# Altium schematic sheet STM32_microcontroller_IOs.SchDoc: STM32 microcontroller IOs
size 420 x 297 mm; CompanyName: STMicroelectronics; Organization: Microcontrollers Division; DocumentNumber: 4; SheetNumber: 3; SheetTotal: 19
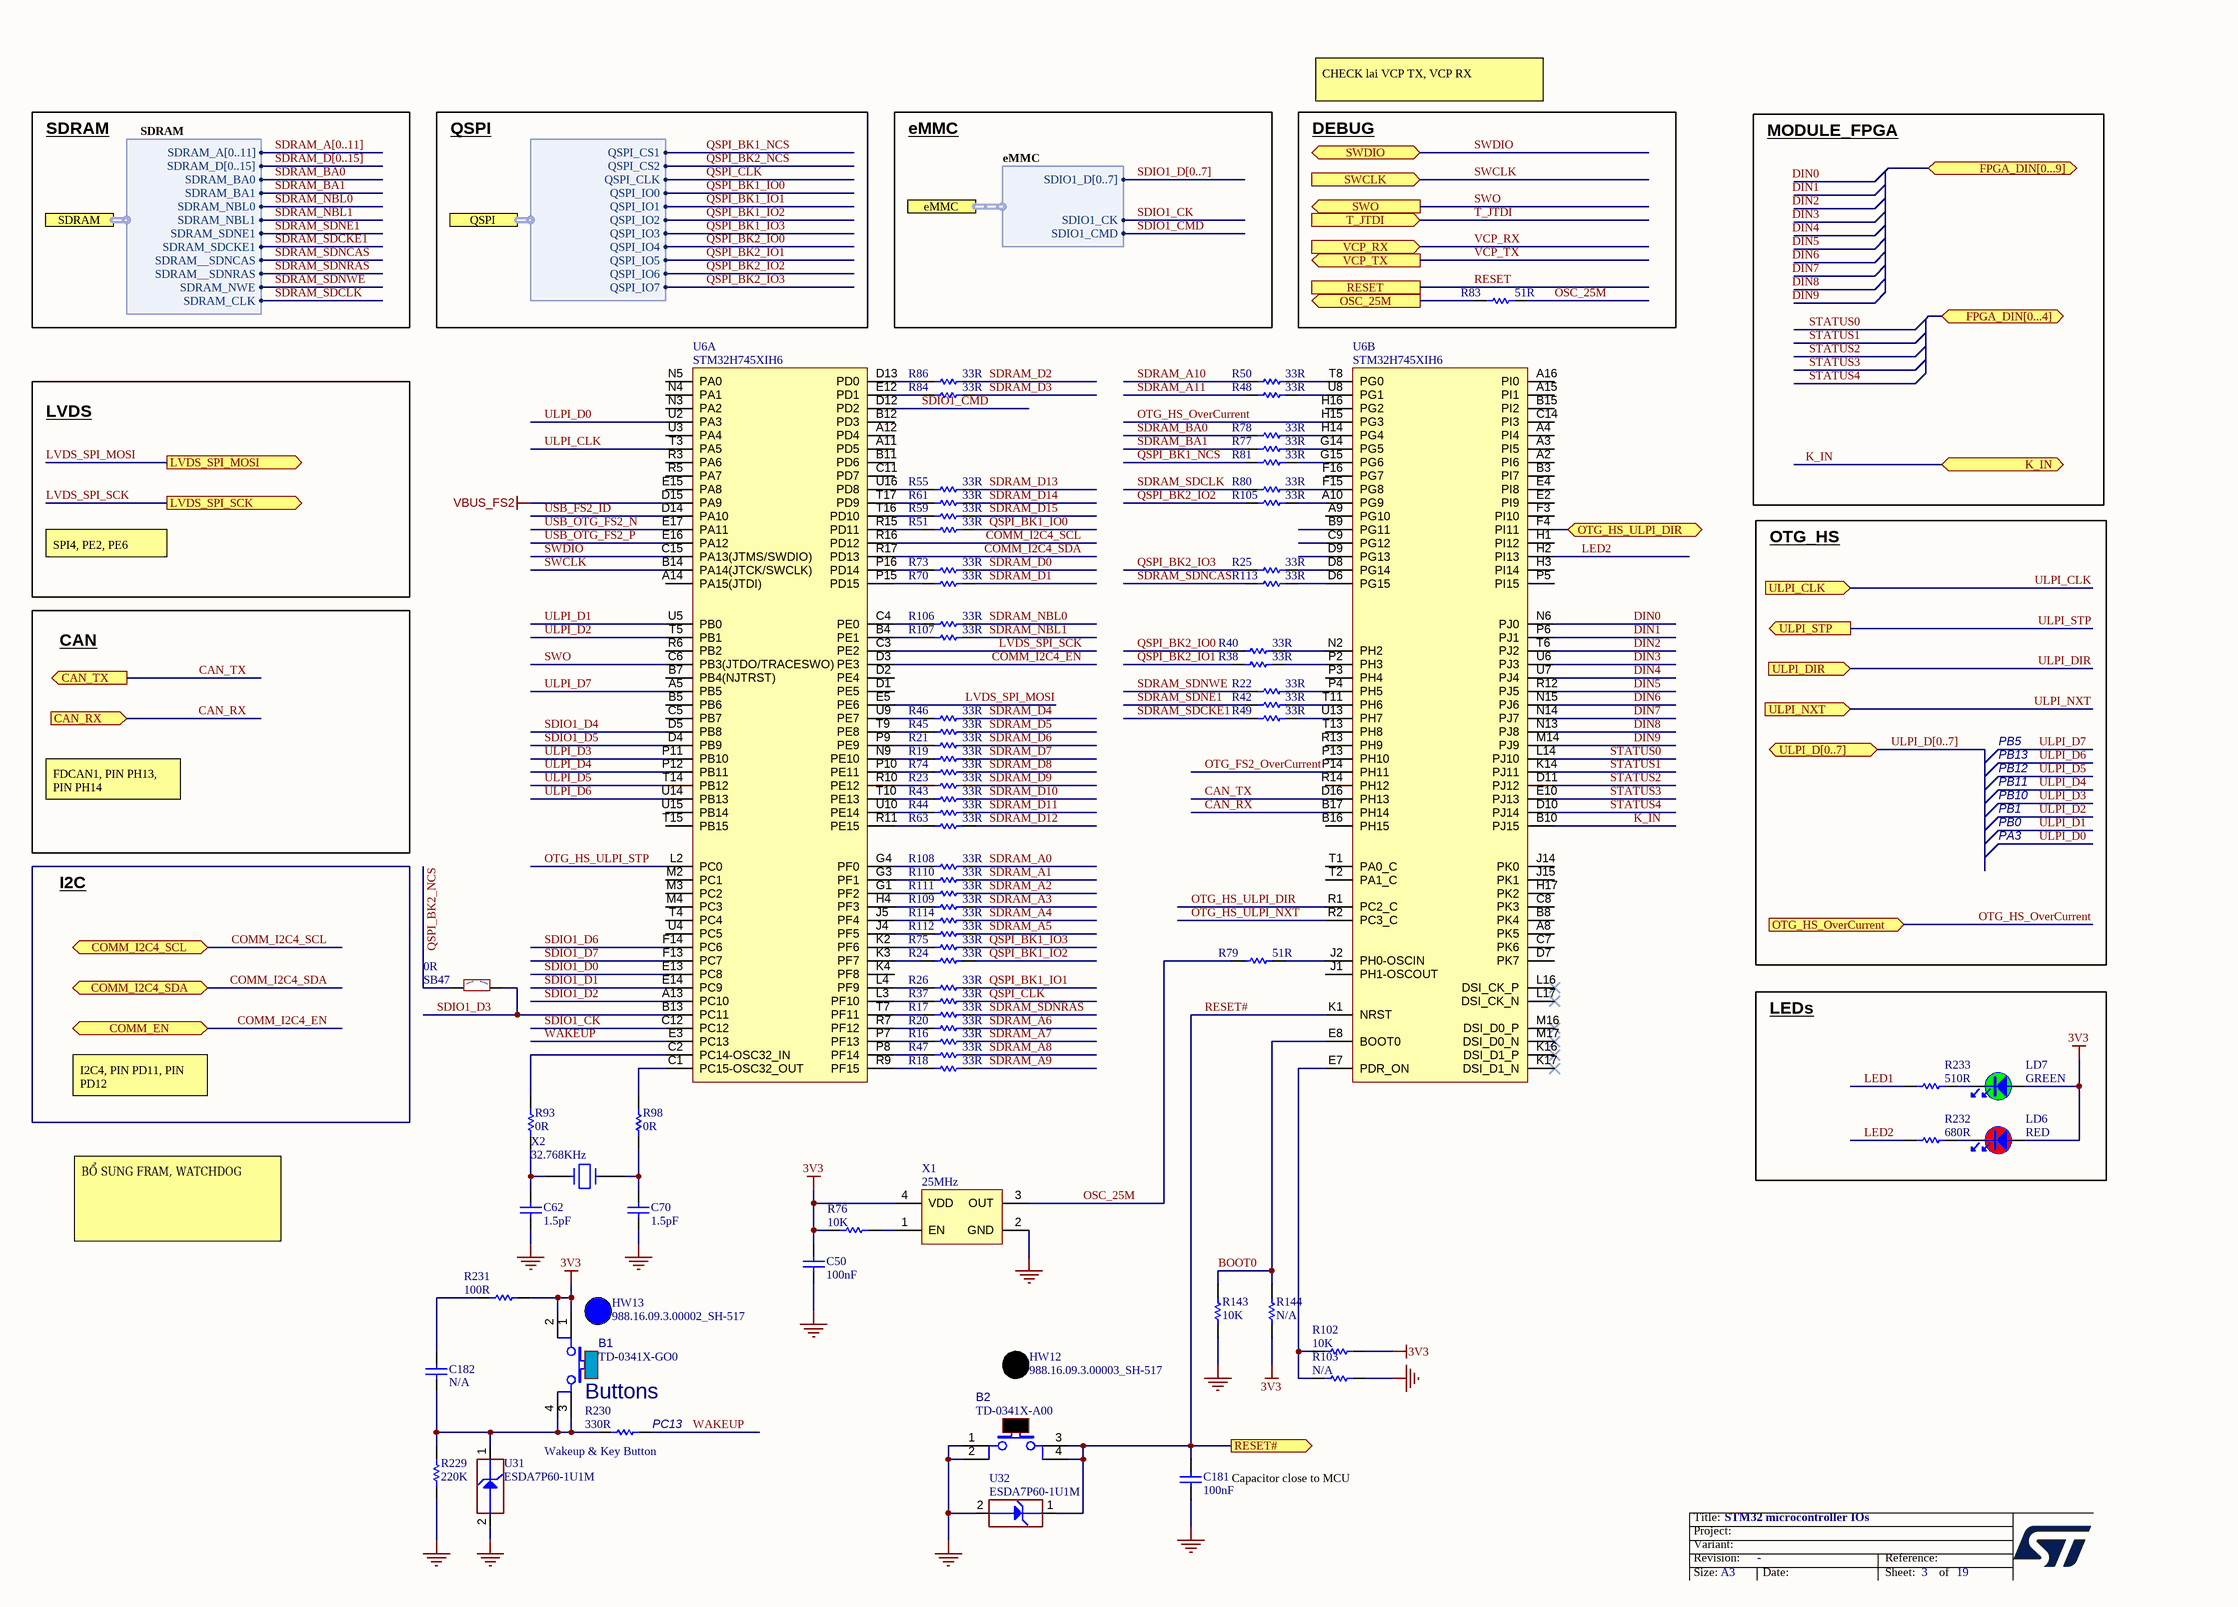
[diagram p0: STM32_microcontroller_IOs.SchDoc]

## Parts
B1  Manufacturer_Part_Number: TD-0341X-GO0  [SWI_WEALTHMETAL_TD-0341_4P_BLUE]  (hidden comment: SW-PUSH-CMS_BLUE)
B2  Manufacturer_Part_Number: TD-0341X-A00  [SWI_WEALTHMETAL_TD-0341_4P_BLACK]  (hidden comment: SW-PUSH-CMS_BLACK)
C50  value 100nF  [C0402]  (hidden comment: Capacitor)
C62  value 1.5pF  [C0402]  (hidden comment: Capacitor)
C70  value 1.5pF  [C0402]  (hidden comment: Capacitor)
C181  value 100nF  [C0402]  (hidden comment: Capacitor)
C182  N/A  [C0402]
HW12  value 988.16.09.3.00003_SH-517  (hidden comment: BUTTON_HAT_BLACK)  (mechanical)
HW13  value 988.16.09.3.00002_SH-517  (hidden comment: BUTTON_HAT_BLUE)  (mechanical)
LD6  value RED  [LED_0603_RED]  (hidden comment: LED_red)
LD7  value GREEN  [LED_0603_GREEN]  (hidden comment: LED_green)
R16  value 33R  [R0402]  (hidden comment: Resistor)
R17  value 33R  [R0402]  (hidden comment: Resistor)
R18  value 33R  [R0402]  (hidden comment: Resistor)
R19  value 33R  [R0402]  (hidden comment: Resistor)
R20  value 33R  [R0402]  (hidden comment: Resistor)
R21  value 33R  [R0402]  (hidden comment: Resistor)
R22  value 33R  [R0402]  (hidden comment: Resistor)
R23  value 33R  [R0402]  (hidden comment: Resistor)
R24  value 33R  [R0402]  (hidden comment: Resistor)
R25  value 33R  [R0402]  (hidden comment: Resistor)
R26  value 33R  [R0402]  (hidden comment: Resistor)
R37  value 33R  [R0402]  (hidden comment: Resistor)
R38  value 33R  [R0402]  (hidden comment: Resistor)
R40  value 33R  [R0402]  (hidden comment: Resistor)
R42  value 33R  [R0402]  (hidden comment: Resistor)
R43  value 33R  [R0402]  (hidden comment: Resistor)
R44  value 33R  [R0402]  (hidden comment: Resistor)
R45  value 33R  [R0402]  (hidden comment: Resistor)
R46  value 33R  [R0402]  (hidden comment: Resistor)
R47  value 33R  [R0402]  (hidden comment: Resistor)
R48  value 33R  [R0402]  (hidden comment: Resistor)
R49  value 33R  [R0402]  (hidden comment: Resistor)
R50  value 33R  [R0402]  (hidden comment: Resistor)
R51  value 33R  [R0402]  (hidden comment: Resistor)
R55  value 33R  [R0402]  (hidden comment: Resistor)
R59  value 33R  [R0402]  (hidden comment: Resistor)
R61  value 33R  [R0402]  (hidden comment: Resistor)
R63  value 33R  [R0402]  (hidden comment: Resistor)
R70  value 33R  [R0402]  (hidden comment: Resistor)
R73  value 33R  [R0402]  (hidden comment: Resistor)
R74  value 33R  [R0402]  (hidden comment: Resistor)
R75  value 33R  [R0402]  (hidden comment: Resistor)
R76  value 10K  [R0402]  (hidden comment: Resistor)
R77  value 33R  [R0402]  (hidden comment: Resistor)
R78  value 33R  [R0402]  (hidden comment: Resistor)
R79  value 51R  [R0402]  (hidden comment: Resistor)
R80  value 33R  [R0402]  (hidden comment: Resistor)
R81  value 33R  [R0402]  (hidden comment: Resistor)
R83  value 51R  [R0402]  (hidden comment: Resistor)
R84  value 33R  [R0402]  (hidden comment: Resistor)
R86  value 33R  [R0402]  (hidden comment: Resistor)
R93  value 0R  [R0603]  (hidden comment: Resistor)
R98  value 0R  [R0603]  (hidden comment: Resistor)
R102  value 10K  [R0402]  (hidden comment: Resistor)
R103  N/A  [R0402]
R105  value 33R  [R0402]  (hidden comment: Resistor)
R106  value 33R  [R0402]  (hidden comment: Resistor)
R107  value 33R  [R0402]  (hidden comment: Resistor)
R108  value 33R  [R0402]  (hidden comment: Resistor)
R109  value 33R  [R0402]  (hidden comment: Resistor)
R110  value 33R  [R0402]  (hidden comment: Resistor)
R111  value 33R  [R0402]  (hidden comment: Resistor)
R112  value 33R  [R0402]  (hidden comment: Resistor)
R113  value 33R  [R0402]  (hidden comment: Resistor)
R114  value 33R  [R0402]  (hidden comment: Resistor)
R143  value 10K  [R0402]  (hidden comment: Resistor)
R144  N/A  [R0402]
R229  value 220K  [R0402]  (hidden comment: Resistor)
R230  value 330R  [R0402]  (hidden comment: Resistor)
R231  value 100R  [R0402]  (hidden comment: Resistor)
R232  value 680R  [R0402]  (hidden comment: Resistor)
R233  value 510R  [R0603]  (hidden comment: Resistor)
SB47  value 0R  [SOLDER-BRIDGE_R0603-0R]  (hidden comment: SB_OFF)
U6  value STM32H745XIH6  [ICC_TFBGA240+25_14X14_STM32H745H6U_P080]  (parts A,B of 3)
U31  value ESDA7P60-1U1M  [ESD_QFN2_1P6X1_P125]  (hidden comment: ESD-TRANSIL)
U32  value ESDA7P60-1U1M  [ESD_QFN2_1P6X1_P125]  (hidden comment: ESD-TRANSIL)
X1  value 25MHz  [OSC_NDK_NZ2520SB_4P]  (hidden comment: Oscillator_4pins)
X2  value 32.768KHz  [CRY_NX3215SA_2P]  (hidden comment: XTAL_32K_NX3215SA)

## Blocks framed on the sheet
DEBUG: R83
LEDs: LD6 LD7 R232 R233

## Ports
CAN_RX (in), CAN_TX (out), COMM_EN (bidir), COMM_I2C4_SCL (bidir), COMM_I2C4_SDA (bidir), eMMC (harness eMMC), FPGA_DIN[0...4] (bidir), FPGA_DIN[0...9] (bidir), K_IN (bidir), LVDS_SPI_MOSI (out), LVDS_SPI_SCK (out), OSC_25M (out), OTG_HS_OverCurrent (in), OTG_HS_ULPI_DIR (bidir), QSPI (harness SPI), RESET, RESET# (out), SDRAM (harness SDRAM), SWCLK (in), SWDIO (bidir), SWO (out), T_JTDI (in), ULPI_CLK (in), ULPI_D[0..7] (bidir), ULPI_DIR (in), ULPI_NXT (in), ULPI_STP (out), VCP_RX (in), VCP_TX (out)

## Harnesses
SDRAM: SDRAM_A[0..11], SDRAM__SDNCAS, SDRAM_NBL0, SDRAM_SDNE1, SDRAM_SDCKE1, SDRAM_D[0..15], SDRAM_NBL1, SDRAM_BA0, SDRAM_BA1, SDRAM_NWE, SDRAM_CLK, SDRAM__SDNRAS
?: QSPI_IO1, QSPI_IO0, QSPI_CLK, QSPI_CS1, QSPI_IO2, QSPI_IO3, QSPI_IO5, QSPI_IO4, QSPI_IO6, QSPI_IO7, QSPI_CS2
eMMC: SDIO1_D[0..7], SDIO1_CMD, SDIO1_CK

## Nets
3V3: B1.1 B1.2 C50.2 LD6.1 LD7.1 R76.2 R102.1 R144.1 R231.2 X1.4(VDD)
GND: B2.1 B2.2 C50.1 C62.1 C70.1 C181.1 R103.1 R143.2 R229.1 U31.2(GND) U32.2(GND) X1.2(GND)
VBUS_FS2: U6.D15(PA9)
BOOT0: R143.1 R144.2 U6.E8(BOOT0)
CAN_RX: U6.B17(PH14) ; port CAN_RX
CAN_TX: U6.D16(PH13) ; port CAN_TX
COMM_I2C4_EN: U6.D3(PE3) ; port COMM_EN
COMM_I2C4_SCL: U6.R16(PD12) ; port COMM_I2C4_SCL
COMM_I2C4_SDA: U6.R17(PD13) ; port COMM_I2C4_SDA
DIN0: U6.N6(PJ0)
DIN1: U6.P6(PJ1)
DIN2: U6.T6(PJ2)
DIN3: U6.U6(PJ3)
DIN4: U6.U7(PJ4)
DIN5: U6.R12(PJ5)
DIN6: U6.N15(PJ6)
DIN7: U6.N14(PJ7)
DIN8: U6.N13(PJ8)
DIN9: U6.M14(PJ9)
K_IN: U6.B10(PJ15) ; port K_IN
LED1: R233.1
LED2: R232.1 U6.H2(PI13)
LVDS_SPI_MOSI: U6.E5(PE6) ; port LVDS_SPI_MOSI
LVDS_SPI_SCK: U6.C3(PE2) ; port LVDS_SPI_SCK
OSC_25M: R79.1 R83.2 X1.3(OUT)
OSC_25M: R83.1 ; port OSC_25M  [a separate net that carries the same name]
OTG_FS2_OverCurrent: U6.P14(PH11)
OTG_HS_OverCurrent: U6.H15(PG3) ; port OTG_HS_OverCurrent
OTG_HS_ULPI_DIR: U6.F4(PI11) ; port OTG_HS_ULPI_DIR
OTG_HS_ULPI_DIR: U6.R1(PC2_C)  [a separate net that carries the same name]
OTG_HS_ULPI_NXT: U6.R2(PC3_C)
OTG_HS_ULPI_STP: U6.L2(PC0)
QSPI_BK1_IO0: R51.2 ; port QSPI.QSPI_IO0
QSPI_BK1_IO1: R26.2 ; port QSPI.QSPI_IO1
QSPI_BK1_IO2: R24.2 ; port QSPI.QSPI_IO2
QSPI_BK1_IO3: R75.2 ; port QSPI.QSPI_IO3
QSPI_BK1_NCS: R81.1 ; port QSPI.QSPI_CS1
QSPI_BK2_IO0: R40.1 ; port QSPI.QSPI_IO4
QSPI_BK2_IO1: R38.1 ; port QSPI.QSPI_IO5
QSPI_BK2_IO2: R105.1 ; port QSPI.QSPI_IO6
QSPI_BK2_IO3: R25.1 ; port QSPI.QSPI_IO7
QSPI_BK2_NCS: SB47.1 ; port QSPI.QSPI_CS2
QSPI_CLK: R37.2 ; port QSPI.QSPI_CLK
RESET: port RESET
RESET#: B2.3 B2.4 C181.2 U6.K1(NRST) U32.1(IO1) ; port RESET#
SDIO1_CK: U6.C12(PC12) ; port eMMC.SDIO1_CK
SDIO1_CMD: U6.D12(PD2) ; port eMMC.SDIO1_CMD
SDIO1_D0: U6.E13(PC8)
SDIO1_D1: U6.E14(PC9)
SDIO1_D2: U6.A13(PC10)
SDIO1_D3: SB47.2 U6.B13(PC11)
SDIO1_D4: U6.D5(PB8)
SDIO1_D5: U6.D4(PB9)
SDIO1_D6: U6.F14(PC6)
SDIO1_D7: U6.F13(PC7)
SDRAM_A0: R108.2
SDRAM_A1: R110.2
SDRAM_A2: R111.2
SDRAM_A3: R109.2
SDRAM_A4: R114.2
SDRAM_A5: R112.2
SDRAM_A6: R20.2
SDRAM_A7: R16.2
SDRAM_A8: R47.2
SDRAM_A9: R18.2
SDRAM_A10: R50.1
SDRAM_A11: R48.1
SDRAM_BA0: R78.1 ; port SDRAM.SDRAM_BA0
SDRAM_BA1: R77.1 ; port SDRAM.SDRAM_BA1
SDRAM_D0: R73.2
SDRAM_D1: R70.2
SDRAM_D2: R86.2
SDRAM_D3: R84.2
SDRAM_D4: R46.2
SDRAM_D5: R45.2
SDRAM_D6: R21.2
SDRAM_D7: R19.2
SDRAM_D8: R74.2
SDRAM_D9: R23.2
SDRAM_D10: R43.2
SDRAM_D11: R44.2
SDRAM_D12: R63.2
SDRAM_D13: R55.2
SDRAM_D14: R61.2
SDRAM_D15: R59.2
SDRAM_NBL0: R106.2 ; port SDRAM.SDRAM_NBL0
SDRAM_NBL1: R107.2 ; port SDRAM.SDRAM_NBL1
SDRAM_SDCKE1: R49.1 ; port SDRAM.SDRAM_SDCKE1
SDRAM_SDCLK: R80.1 ; port SDRAM.SDRAM_CLK
SDRAM_SDNCAS: R113.1 ; port SDRAM.SDRAM__SDNCAS
SDRAM_SDNE1: R42.1 ; port SDRAM.SDRAM_SDNE1
SDRAM_SDNRAS: R17.2 ; port SDRAM.SDRAM__SDNRAS
SDRAM_SDNWE: R22.1 ; port SDRAM.SDRAM_NWE
STATUS0: U6.L14(PJ10)
STATUS1: U6.K14(PJ11)
STATUS2: U6.D11(PJ12)
STATUS3: U6.E10(PJ13)
STATUS4: U6.D10(PJ14)
SWCLK: U6.B14(PA14(JTCK/SWCLK)) ; port SWCLK
SWDIO: U6.C15(PA13(JTMS/SWDIO)) ; port SWDIO
SWO: U6.C6(PB3(JTDO/TRACESWO)) ; port SWO
T_JTDI: port T_JTDI
ULPI_CLK: U6.T3(PA5) ; port ULPI_CLK
ULPI_D0: U6.U2(PA3)
ULPI_D1: U6.U5(PB0)
ULPI_D2: U6.T5(PB1)
ULPI_D3: U6.P11(PB10)
ULPI_D4: U6.P12(PB11)
ULPI_D5: U6.T14(PB12)
ULPI_D6: U6.U14(PB13)
ULPI_D7: U6.A5(PB5)
ULPI_DIR: port ULPI_DIR
ULPI_NXT: port ULPI_NXT
ULPI_STP: port ULPI_STP
USB_FS2_ID: U6.D14(PA10)
USB_OTG_FS2_N: U6.E17(PA11)
USB_OTG_FS2_P: U6.E16(PA12)
VCP_RX: port VCP_RX
VCP_TX: port VCP_TX
WAKEUP: R230.2 U6.E3(PC13)
NetB1_3: B1.3 B1.4 C182.2 R229.2 R230.1 U31.1(IO1)
NetC62_2: C62.2 R93.2 X2.1
NetC70_2: C70.2 R98.2 X2.2
NetC182_1: C182.1 R231.1
NetLD6_2: LD6.2 R232.2
NetLD7_2: LD7.2 R233.2
NetR16_1: R16.1 U6.P7(PF13)
NetR17_1: R17.1 U6.T7(PF11)
NetR18_1: R18.1 U6.R9(PF15)
NetR19_1: R19.1 U6.N9(PE10)
NetR20_1: R20.1 U6.R7(PF12)
NetR21_1: R21.1 U6.P9(PE9)
NetR22_2: R22.2 U6.P4(PH5)
NetR23_1: R23.1 U6.R10(PE12)
NetR24_1: R24.1 U6.K3(PF7)
NetR25_2: R25.2 U6.D8(PG14)
NetR26_1: R26.1 U6.L4(PF9)
NetR37_1: R37.1 U6.L3(PF10)
NetR38_2: R38.2 U6.P2(PH3)
NetR40_2: R40.2 U6.N2(PH2)
NetR42_2: R42.2 U6.T11(PH6)
NetR43_1: R43.1 U6.T10(PE13)
NetR44_1: R44.1 U6.U10(PE14)
NetR45_1: R45.1 U6.T9(PE8)
NetR46_1: R46.1 U6.U9(PE7)
NetR47_1: R47.1 U6.P8(PF14)
NetR48_2: R48.2 U6.U8(PG1)
NetR49_2: R49.2 U6.U13(PH7)
NetR50_2: R50.2 U6.T8(PG0)
NetR51_1: R51.1 U6.R15(PD11)
NetR55_1: R55.1 U6.U16(PD8)
NetR59_1: R59.1 U6.T16(PD10)
NetR61_1: R61.1 U6.T17(PD9)
NetR63_1: R63.1 U6.R11(PE15)
NetR70_1: R70.1 U6.P15(PD15)
NetR73_1: R73.1 U6.P16(PD14)
NetR74_1: R74.1 U6.P10(PE11)
NetR75_1: R75.1 U6.K2(PF6)
NetR76_1: R76.1 X1.1(EN)
NetR77_2: R77.2 U6.G14(PG5)
NetR78_2: R78.2 U6.H14(PG4)
NetR79_2: R79.2 U6.J2(PH0-OSCIN)
NetR80_2: R80.2 U6.F15(PG8)
NetR81_2: R81.2 U6.G15(PG6)
NetR84_1: R84.1 U6.E12(PD1)
NetR86_1: R86.1 U6.D13(PD0)
NetR93_1: R93.1 U6.C2(PC14-OSC32_IN)
NetR98_1: R98.1 U6.C1(PC15-OSC32_OUT)
NetR102_2: R102.2 R103.2 U6.E7(PDR_ON)
NetR105_2: R105.2 U6.A10(PG9)
NetR106_1: R106.1 U6.C4(PE0)
NetR107_1: R107.1 U6.B4(PE1)
NetR108_1: R108.1 U6.G4(PF0)
NetR109_1: R109.1 U6.H4(PF3)
NetR110_1: R110.1 U6.G3(PF1)
NetR111_1: R111.1 U6.G1(PF2)
NetR112_1: R112.1 U6.J4(PF5)
NetR113_2: R113.2 U6.D6(PG15)
NetR114_1: R114.1 U6.J5(PF4)

Not connected (* = marked no-connect by the designer): U6 A2(PI6) A3(PI5) A4(PI4) A8(PK5) A9(PG10) A11(PD5) A12(PD4) A14(PA15(JTDI)) A15(PI1) A16(PI0) B3(PI7) B5(PB6) B7(PB4(NJTRST)) B8(PK4) B9(PG11) B11(PD6) B12(PD3) B15(PI2) B16(PH15) C5(PB7) C7(PK6) C8(PK3) C9(PG12) C11(PD7) C14(PI3) D1(PE5) D2(PE4) D7(PK7) D9(PG13) E2(PI9) E4(PI8) E15(PA8) F3(PI10) F16(PG7) H1(PI12) H3(PI14) H16(PG2) H17(PK2) J1(PH1-OSCOUT) J14(PK0) J15(PK1) K4(PF8) K16(DSI_D1_P)* K17(DSI_D1_N)* L16(DSI_CK_P)* L17(DSI_CK_N)* M2(PC1) M3(PC2) M4(PC3) M16(DSI_D0_P)* M17(DSI_D0_N)* N3(PA2) N4(PA1) N5(PA0) P3(PH4) P5(PI15) P13(PH10) R3(PA6) R5(PA7) R6(PB2) R13(PH9) R14(PH12) T1(PA0_C) T2(PA1_C) T4(PC4) T13(PH8) T15(PB15) U3(PA4) U4(PC5) U15(PB14)

## Buses and harness runs
bus SDIO1_D[0..7]
bus SDRAM_A[0..11]
bus SDRAM_D[0..15]
bus ULPI_D[0..7] = port ULPI_D[0..7]

## Notes on the sheet
- CHECK lai VCP TX, VCP RX
- SDRAM
- QSPI
- eMMC
- MODULE_FPGA
- LVDS
- SPI4, PE2, PE6
- OTG_HS
- CAN
- FDCAN1, PIN PH13, PIN PH14
- PB10
- PB11
- PB12
- PB13
- PB5
- PA3
- PB0
- PB1
- I2C
- I2C4, PIN PD11, PIN PD12
- BỔ SUNG FRAM, WATCHDOG
- (near B1) Buttons
- (near R230) Wakeup & Key Button
- (near R230) PC13
- (near C181) Capacitor close to MCU
- Title:
- Project:
- Size:
- Revision:
- Variant:
- A3
- -
- Date:
- Reference:
- Sheet:
- of

## Library data of the parts
B1 = MCD-00002: Non-Open Push-Button 0.1A 24V BLUE; Part_Type: Misc; Manufacturer: WEALTHMETAL; Part_Preference: Not recommended; Partial_Alternate_Internal_Part_Number: MCD-03589; Value: TD-0341X-GO0; Provided_By: Subcon; Initial_Board_Reference: MB1274; Alternate_EMS: A; Component_Country_Of_Origin: Unknown; ID: 2464; ShowFields: YES; Internal_Part_Number: MCD-00002; Status: Checked; ComponentLink1Description: Datasheet; ComponentLink1URL: http://tunmcdsvn.tun.st.com/Component_Documentation_Library/Trunk/Misc/WEALTHMETAL_TD-0341; Order_Code_Farnell: N/A; Manufacturer_HQ_COO: Unknown; Order_Code_Digikey: N/A; Order_Code_RS: N/A; Package: 6x10mm
B2 = MCD-00001: Non-Open Push-Button 0.1A 24V BLACK; Part_Type: Misc; Manufacturer: WEALTHMETAL; Part_Preference: Not recommended; Partial_Alternate_Internal_Part_Number: MCD-03587; Value: TD-0341X-A00; Provided_By: Subcon; Initial_Board_Reference: MB1274; Alternate_EMS: A; Component_Country_Of_Origin: Unknown; ID: 2463; ShowFields: YES; Internal_Part_Number: MCD-00001; Status: Released; ComponentLink1Description: Datasheet; ComponentLink1URL: http://tunmcdsvn.tun.st.com/Component_Documentation_Library/Trunk/Misc/WEALTHMETAL_TD-0341; Order_Code_Farnell: N/A; Order_Code_Digikey: N/A; Order_Code_RS: N/A; Package: 6x10mm
C50 C181 C182 = MCD-00006: Capacitor, MLCC, 100nF, 16V, X7R, +/-10%, 0402, T=0.5mm; Manufacturer_Part_Number: CC0402KRX7R7BB104; Manufacturer: YAGEO; Part_Preference: Recommended; Partial_Alternate_Internal_Part_Number: MCD-03299; Component_Country_Of_Origin: China; ID: 2474; Order_Code_RS: 9402047; ShowFields: YES; Internal_Part_Number: MCD-00006; Status: Released; Part_Type: Capacitor; Package: 0402; ComponentLink1URL: http://tunmcdsvn.tun.st.com/Component_Documentation_Library/Trunk/Capacitor/YAGEO_X7R_Series; Order_Code_Digikey: 311-1338-1-ND; Order_Code_Farnell: 9402047
  C182: Value: 100nF
C62 C70 = MCD-00563: Capacitor, MLCC, 1.5pF, 50V, NPO, +-0.25pF, 0402, T=0,5mm; Manufacturer_Part_Number: CC0402CRNPO9BN1R5; Manufacturer: YAGEO; Part_Preference: Recommended; Partial_Alternate_Internal_Part_Number: MCD-01460; Provided_By: Subcon; Initial_Board_Reference: MB1331; Component_Country_Of_Origin: China; ID: 3175; ShowFields: YES; Internal_Part_Number: MCD-00563; Status: Released; Part_Type: Capacitor; Package: 0402; ComponentLink1Description: Yageo_Capacitor_NP0_16V-to-50V.pdf; ComponentLink1URL: http://tunmcdsvn.tun.st.com/Component_Documentation_Library/Trunk/Capacitor/YAGEO_NP0_Series; ECCN_US: n/a; ECCN_EU: n/a; Order_Code_Digikey: 311-1003-1-ND; Order_Code_Farnell: 3019111; Order_Code_RS: N/A
HW12 = MCD-00635: Black Hat for switch TD0341X-G01-BLA; Part_Type: Mechanical; Manufacturer: JIUBABA; Part_Preference: Alternate; Provided_By: Subcon; Initial_Board_Reference: mb1319; Alternate_EMS: A; Component_Country_Of_Origin: Unknown; ID: 3106; ShowFields: YES; Internal_Part_Number: MCD-00635; Status: Released; Manufacturer_Part_Number: 988.16.09.3.00003_SH-517; ECCN_US: n/a; ECCN_EU: n/a; ComponentLink1Description: Juibaba_HAT_SH-517.pdf; ComponentLink1URL: http://tunmcdsvn.tun.st.com/Component_Documentation_Library/Trunk/Misc/JIUBABA_988.16.09.3.00003_SH-517; Order_Code_Digikey: N/A; Order_Code_Farnell: N/A; Order_Code_RS: N/A; Package: diameter=4.5mm; Manufacturer_HQ_COO: Unknown
HW13 = MCD-00634: Blue Hat for switch TD0341X-G01-BLU; Part_Type: Mechanical; Manufacturer: JIUBABA; Part_Preference: Alternate; Provided_By: Subcon; Initial_Board_Reference: mb1319; Alternate_EMS: A; Component_Country_Of_Origin: Unknown; ID: 3112; ShowFields: YES; Internal_Part_Number: MCD-00634; Status: Released; Manufacturer_Part_Number: 988.16.09.3.00002_SH-517; ECCN_US: n/a; ECCN_EU: n/a; ComponentLink1Description: Juibaba_HAT_SH-517.pdf; ComponentLink1URL: http://tunmcdsvn.tun.st.com/Component_Documentation_Library/Trunk/Misc/JIUBABA_988.16.09.3.00002_SH-517; Order_Code_Digikey: N/A; Order_Code_Farnell: N/A; Order_Code_RS: N/A; Package: diameter=4.5mm; Manufacturer_HQ_COO: Unknown
LD6 = MCD-02899: LED, Red, VF : Min=1.75V , Max=2.35V, 25mA, 0603; Part_Type: Display; Part_Preference: Recommended; Manufacturer: EVERLIGHT; Manufacturer_Part_Number: 19-213/R6C-AP1Q2B/5T; Full_Alternate_Internal_Part_Number: MCD-00049; Component_Country_Of_Origin: China; ShowFields: YES; ID: 5015; Internal_Part_Number: MCD-02899; Status: Checked; Package: 0603; ComponentLink1URL: http://tunmcdsvn.tun.st.com/Component_Documentation_Library/Trunk/Display/EVERLIGHT_19-213-R6C-AP1Q2B-5T; Order_Code_Digikey: 1080-19-213/R6C-AP1Q2B/5TTR-ND; Order_Code_Farnell: N/A; Order_Code_RS: N/A
LD7 = MCD-02900: LED, Green, 2V, 25mA, 0603, SMD; Part_Type: Display; Part_Preference: Recommended; Manufacturer: EVERLIGHT; Manufacturer_Part_Number: 19-213SYGC/S530-E2/5T; Full_Alternate_Internal_Part_Number: MCD-00320; Partial_Alternate_Internal_Part_Number: MCD-00050; Component_Country_Of_Origin: China; ShowFields: YES; ID: 5016; Internal_Part_Number: MCD-02900; Status: Checked; Package: 0603; ComponentLink1URL: http://tunmcdsvn.tun.st.com/Component_Documentation_Library/Trunk/Display/EVERLIGHT_19-213SYGC-S530-E2-5T; Order_Code_Digikey: 1080-19-213SYGC/S530-E2/5TTR-ND; Order_Code_Farnell: N/A; Order_Code_RS: N/A
R16-R26 R37 R38 R40 R42-R51 R55 R59 R61 R63 R70 R73-R75 R77 R78 R80 R81 R84 R86 R105-R114 = MCD-00455: Resistor,33R,0402,1%,1/16W; Manufacturer_Part_Number: RC0402FR-0733RL; Manufacturer: YAGEO; Part_Preference: Recommended; Provided_By: Subcon; Component_Country_Of_Origin: China; ID: 2821; ShowFields: YES; Internal_Part_Number: MCD-00455; Status: Released; Part_Type: Resistor; Package: 0402; ComponentLink1Description: Yageo_Resistor_RC0402-series.pdf; ComponentLink1URL: http://tunmcdsvn.tun.st.com/Component_Documentation_Library/Trunk/Resistor/YAGEO_RC_L_Series; ECCN_US: n/a; ECCN_EU: n/a; Order_Code_Digikey: 311-33.0LRCT-ND; Order_Code_Farnell: 9239057; Order_Code_RS: N/A
R76 R102 R103 R143 R144 = MCD-00053: Resistor,10K,0402,1%,1/16W; Manufacturer_Part_Number: RC0402FR-0710KL; Manufacturer: YAGEO; BMS_Part_Number: 9131590; Part_Preference: Recommended; Provided_By: subcon; Initial_Board_Reference: MB1274; Component_Country_Of_Origin: China; ID: 2539; Order_Code_RS: 9239359; ShowFields: YES; Internal_Part_Number: MCD-00053; Status: Released; Part_Type: Resistor; Package: 0402; ComponentLink1Description: Yageo_Resistor_RC0402-series.pdf; ComponentLink1URL: http://tunmcdsvn.tun.st.com/Component_Documentation_Library/Trunk/Resistor/YAGEO_RC_L_Series; ECCN_US: n/a; ECCN_EU: n/a; Order_Code_Digikey: 311-10.0KLRCT-ND; Order_Code_Farnell: 9239359
  R103 R144: Value: 10K
R79 R83 = MCD-00485: Resistor,51R,0402,1%,1/16W; Manufacturer_Part_Number: RC0402FR-0751RL; Manufacturer: YAGEO; Part_Preference: Recommended; Provided_By: Subcon; Component_Country_Of_Origin: China; ID: 2790; ShowFields: YES; Internal_Part_Number: MCD-00485; Status: Released; Part_Type: Resistor; Package: 0402; ComponentLink1Description: Yageo_Resistor_RC0402-series.pdf; ComponentLink1URL: http://tunmcdsvn.tun.st.com/Component_Documentation_Library/Trunk/Resistor/YAGEO_RC_L_Series; ECCN_US: n/a; ECCN_EU: n/a; Order_Code_Digikey: 311-51.0LRCT-ND; Order_Code_Farnell: 1458803; Order_Code_RS: N/A
R93 R98 = MCD-00181: Resistor,0R,0603,ULO; Manufacturer_Part_Number: PMR03EZPJ000; Manufacturer: ROHM SEMICONDUCTOR; Part_Preference: Recommended; Provided_By: Subcon; Component_Country_Of_Origin: Philippines, Thailand°°; ID: 2691; ShowFields: YES; Internal_Part_Number: MCD-00181; Status: Released; Part_Type: Resistor; Package: 0603; ComponentLink1Description: ROHM_ULtra low Ohmic Resistor _PMR10EZPJ000.pdf; ComponentLink1URL: http://tunmcdsvn.tun.st.com/Component_Documentation_Library/Trunk/Resistor/ROHM_PMR_Series; ECCN_US: n/a; ECCN_EU: n/a; Order_Code_Digikey: PMR03EZPJ000-ND; Order_Code_Farnell: N/A; Order_Code_RS: N/A
R229 = MCD-00164: Resistor,220K,0402,1%,1/16W; Manufacturer_Part_Number: RC0402FR-07220KL; Manufacturer: YAGEO; Part_Preference: Recommended; Provided_By: Subcon; Initial_Board_Reference: MB1264; Component_Country_Of_Origin: China; ID: 2704; ShowFields: YES; Internal_Part_Number: MCD-00164; Status: Released; Part_Type: Resistor; Package: 0402; ComponentLink1Description: Yageo_Resistor_RC0402-series.pdf; ComponentLink1URL: http://tunmcdsvn.tun.st.com/Component_Documentation_Library/Trunk/Resistor/YAGEO_RC_L_Series; ECCN_US: n/a; ECCN_EU: n/a; Order_Code_Digikey: 311-220KLRCT-ND; Order_Code_Farnell: 9239510; Order_Code_RS: N/A
R230 = MCD-00062: Resistor,330R,0402,1%,1/16W; Manufacturer_Part_Number: RC0402FR-07330RL; Manufacturer: YAGEO; Part_Preference: Recommended; Provided_By: Subcon; Initial_Board_Reference: MB1274; Component_Country_Of_Origin: China; ID: 2529; Order_Code_RS: 9239170; ShowFields: YES; Internal_Part_Number: MCD-00062; Status: Released; Part_Type: Resistor; Package: 0402; ComponentLink1Description: Yageo_Resistor_RC0402-series.pdf; ComponentLink1URL: http://tunmcdsvn.tun.st.com/Component_Documentation_Library/Trunk/Resistor/YAGEO_RC_L_Series; ECCN_US: n/a; ECCN_EU: n/a; Order_Code_Digikey: 311-330LRCT-ND; Order_Code_Farnell: 9239170
R231 = MCD-00067: Resistor, 100R, 0402, +/- 1%, 1/16W; Manufacturer_Part_Number: RC0402FR-07100RL; Manufacturer: YAGEO; Part_Preference: Recommended; Component_Country_Of_Origin: China; ID: 2527; Order_Code_RS: 9239111; ShowFields: YES; Internal_Part_Number: MCD-00067; Status: Released; Part_Type: Resistor; Package: 0402; ComponentLink1URL: http://tunmcdsvn.tun.st.com/Component_Documentation_Library/Trunk/Resistor/YAGEO_RC_L_Series; Order_Code_Digikey: 311-100LRCT-ND; Order_Code_Farnell: 9239111
R232 = MCD-00507: Resistor,680R,0402,1%,1/16W; Manufacturer_Part_Number: RC0402FR-07680RL; Manufacturer: YAGEO; Part_Preference: Recommended; Provided_By: Subcon; Component_Country_Of_Origin: China; ID: 3238; ShowFields: YES; Internal_Part_Number: MCD-00507; Status: Released; Part_Type: Resistor; Package: 0402; ComponentLink1Description: Yageo_Resistor_RC0402-series.pdf; ComponentLink1URL: http://tunmcdsvn.tun.st.com/Component_Documentation_Library/Trunk/Resistor/YAGEO_RC_L_Series; ECCN_US: n/a; ECCN_EU: n/a; Order_Code_Digikey: 311-680LRCT-ND; Order_Code_Farnell: 9239219; Order_Code_RS: N/A
R233 = MCD-00225: Resistor,510R,0603,1%,1/10W; Manufacturer_Part_Number: RC0603FR-07510RL; Manufacturer: YAGEO; Part_Preference: Recommended; Provided_By: Subcon; Initial_Board_Reference: mb1319; Component_Country_Of_Origin: China; ID: 2644; ShowFields: YES; Internal_Part_Number: MCD-00225; ECCN_US: n/a; ECCN_EU: n/a; ComponentLink1Description: Yageo_Resistor_RC0603-series.pdf; Status: Released; Part_Type: Resistor; Package: 0603; ComponentLink1URL: http://tunmcdsvn.tun.st.com/Component_Documentation_Library/Trunk/Resistor/YAGEO_RC_L_Series; Order_Code_Digikey: 311-510HRCT-ND; Order_Code_Farnell: 1799351; Order_Code_RS: N/A
SB47 = MCD-00072: Solder Bridge OFF; Part_Type: Resistor; Manufacturer: YAGEO; Manufacturer_HQ_COO: Unknown; Manufacturer_Part_Number: RC0603JR-070RL; Part_Preference: Recommended; Initial_Board_Reference: mb1274; Component_Country_Of_Origin: China; ID: 2520; Order_Code_RS: 199-5647; ShowFields: YES; Internal_Part_Number: MCD-00072; Status: Released; ECCN_US: n/a; ECCN_EU: n/a; Provided_By: n/a; ComponentLink1URL: http://tunmcdsvn.tun.st.com/Component_Documentation_Library/Trunk/Resistor/YAGEO_RC_Series; Order_Code_Digikey: 311-0.0GRTR-ND; Order_Code_Farnell: 2421846; Package: 0603
U6 = MCD-01085: 32bit MCU TFBGA240+25; Part_Type: IC; Manufacturer: STMICROELECTRONICS; BMS_Part_Number: 9175307; Manufacturer_HQ_COO: EU; Part_Preference: Recommended; Provided_By: STM; Initial_Board_Reference: MB1381; Component_Country_Of_Origin: Philippines; ID: 3408; ShowFields: YES; Internal_Part_Number: MCD-01085; Status: Checked; Manufacturer_Part_Number: STM32H745XIH6; Package: TFBGA-265; ComponentLink1Description: Datasheet; ComponentLink1URL: http://tunmcdsvn.tun.st.com/Component_Documentation_Library/Trunk/IC/STMICROELECTRONICS_STM32H745x; Order_Code_Digikey: 497-19502-ND; Order_Code_Farnell: 3365366; Order_Code_RS: N/A
U31 U32 = MCD-00251: High power transient voltage suppressor, 7V breakdown; Part_Type: Diode; Manufacturer: STMICROELECTRONICS; BMS_Part_Number: 9179042; Manufacturer_HQ_COO: EU; Part_Preference: Recommended; ECCN_US: EAR99; ECCN_EU: NEC; Provided_By: Subcon; Initial_Board_Reference: MB1311; Component_Country_Of_Origin: China; ID: 2618; Order_Code_RS: 110-6381; ShowFields: YES; Internal_Part_Number: MCD-00251; Status: Released; Manufacturer_Part_Number: ESDA7P60-1U1M; ComponentLink1Description: STM_ESD_ESDA7P60-1U1M.pdf; ComponentLink1URL: http://tunmcdsvn.tun.st.com/Component_Documentation_Library/Trunk/Diode/STMICROELECTRONICS_ESDA7P60-1U1M; Order_Code_Digikey: 497-16253-2-ND; Order_Code_Farnell: N/A; Package: QFN1610
X1 = MCD-00597: Oscillator 25.00Mhz, -+50PPM, 3.3V, Temp -55 to +125°C; Part_Type: Crystal_Osc; Manufacturer_Part_Number: NZ2520SH-25MHZ-END4869C; Manufacturer: NDK; Alternate_Manufacturer_Part_Number: KC2520B25.0000C10E00; Alternate_Manufacturer: AVX CORP/KYOCERA CORP; BMS_Part_Number: 9157050; Part_Preference: Recommended; Provided_By: STM; Initial_Board_Reference: MB1331; Component_Country_Of_Origin: Unknown; ID: 3148; ShowFields: YES; Internal_Part_Number: MCD-00597; Status: Released; ComponentLink1Description: NDK_OSCILLATOR_NZ2520SB.pdf; ComponentLink1URL: http://tunmcdsvn.tun.st.com/Component_Documentation_Library/Trunk/Crystal_Oscillator/NDK_NZ2520SH_Series; Order_Code_Digikey: N/A; ECCN_US: n/a; ECCN_EU: n/a; Order_Code_Farnell: N/A; Order_Code_RS: N/A; Package: 2.5x2.0mm
X2 = MCD-00091: Crystal 32.768kHz, 6pF, -+20PPM, R=50K, SMD; Part_Type: Crystal_Osc; Manufacturer_Part_Number: NX3215SA-32.768KHZ-EXS00A-MU00525; Manufacturer: NDK; BMS_Part_Number: 9157034; Part_Preference: Recommended; ECCN_US: EAR99; ECCN_EU: NEC; Provided_By: STM; Initial_Board_Reference: mb1274; Component_Country_Of_Origin: Unknown; ID: 2553; ShowFields: YES; Internal_Part_Number: MCD-00091; Status: Released; ComponentLink1Description: NDK_Crystal-For-ST_NX3215SA 32.768KHz EXS00A-MU00525 (EXS10B-21238).pdf; ComponentLink1URL: http://tunmcdsvn.tun.st.com/Component_Documentation_Library/Trunk/Crystal_Oscillator/NDK_NX3215SA_Series; Order_Code_Digikey: 644-1386; Order_Code_Farnell: N/A; Order_Code_RS: N/A; Package: 3.2x1.5mm